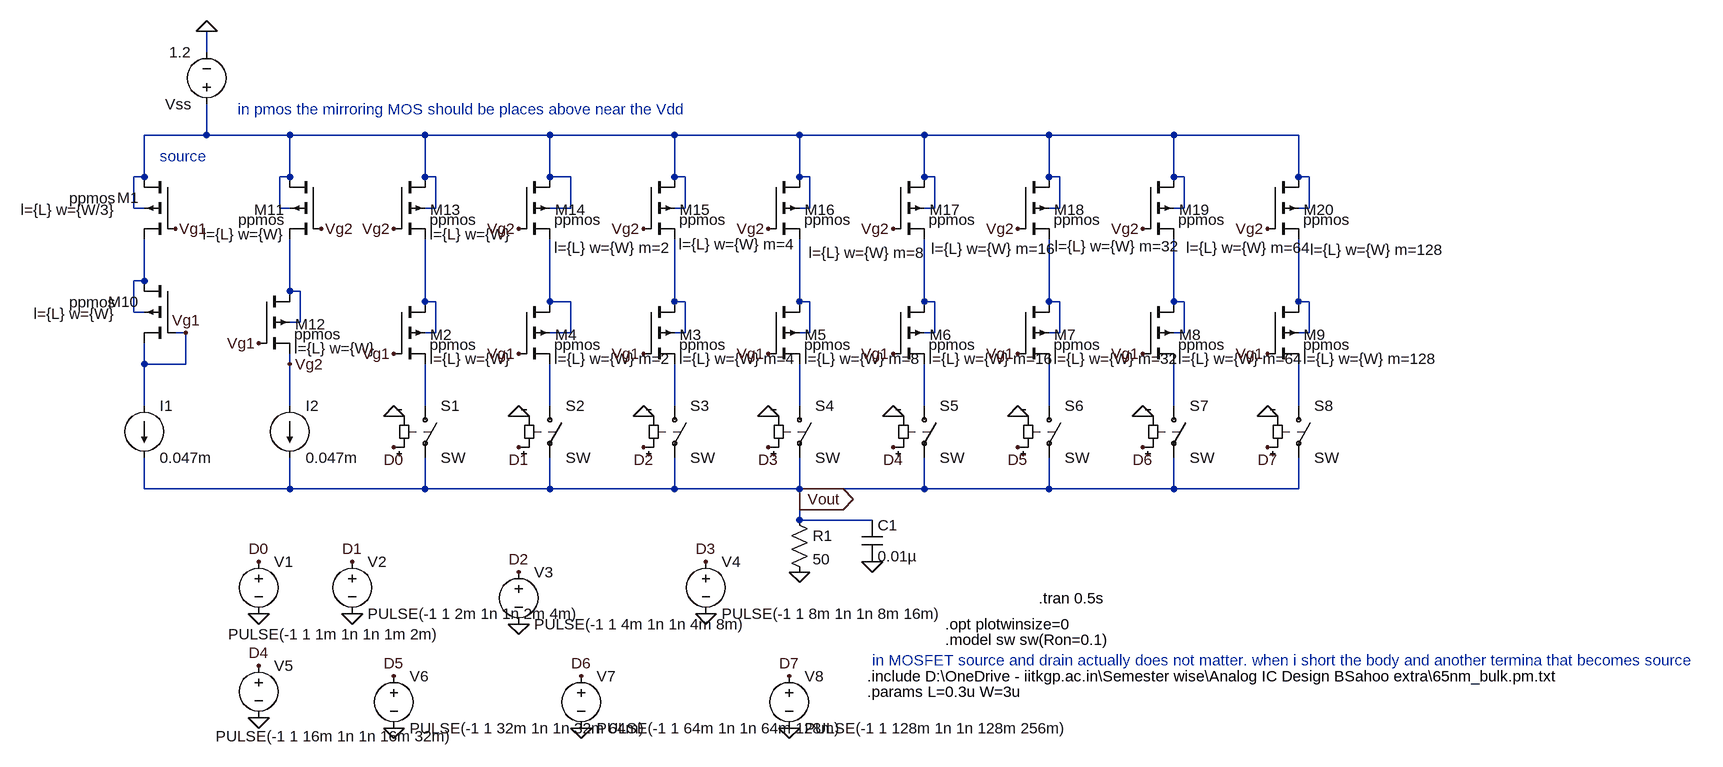
[diagram p0: schematic long_channel_pulse_generator.asc]
long_channel_pulse_generator.asc, the LTspice schematic file:
Version 4
SHEET 1 1092 1000
WIRE -816 -80 -816 -112
WIRE -816 48 -816 0
WIRE -816 48 -912 48
WIRE -688 48 -816 48
WIRE -480 48 -688 48
WIRE -288 48 -480 48
WIRE -96 48 -288 48
WIRE 96 48 -96 48
WIRE 288 48 96 48
WIRE 480 48 288 48
WIRE 672 48 480 48
WIRE 864 48 672 48
WIRE -912 112 -912 48
WIRE -912 112 -928 112
WIRE -688 112 -688 48
WIRE -688 112 -704 112
WIRE -480 112 -480 48
WIRE -464 112 -480 112
WIRE -288 112 -288 48
WIRE -256 112 -288 112
WIRE -96 112 -96 48
WIRE -80 112 -96 112
WIRE 96 112 96 48
WIRE 112 112 96 112
WIRE 288 112 288 48
WIRE 304 112 288 112
WIRE 480 112 480 48
WIRE 496 112 480 112
WIRE 672 112 672 48
WIRE 688 112 672 112
WIRE 864 112 864 48
WIRE 880 112 864 112
WIRE -928 160 -928 112
WIRE -912 160 -928 160
WIRE -704 160 -704 112
WIRE -688 160 -704 160
WIRE -464 160 -464 112
WIRE -464 160 -480 160
WIRE -256 160 -256 112
WIRE -256 160 -288 160
WIRE -80 160 -80 112
WIRE -80 160 -96 160
WIRE 112 160 112 112
WIRE 112 160 96 160
WIRE 304 160 304 112
WIRE 304 160 288 160
WIRE 496 160 496 112
WIRE 496 160 480 160
WIRE 688 160 688 112
WIRE 688 160 672 160
WIRE 880 160 880 112
WIRE 880 160 864 160
WIRE -912 272 -912 208
WIRE -912 272 -928 272
WIRE -688 288 -688 208
WIRE -672 288 -688 288
WIRE -480 304 -480 208
WIRE -464 304 -480 304
WIRE -288 304 -288 208
WIRE -256 304 -288 304
WIRE -96 304 -96 208
WIRE -80 304 -96 304
WIRE 96 304 96 208
WIRE 112 304 96 304
WIRE 288 304 288 208
WIRE 304 304 288 304
WIRE 480 304 480 208
WIRE 496 304 480 304
WIRE 672 304 672 208
WIRE 688 304 672 304
WIRE 864 304 864 208
WIRE 880 304 864 304
WIRE -928 320 -928 272
WIRE -912 320 -928 320
WIRE -672 336 -672 288
WIRE -672 336 -688 336
WIRE -848 352 -864 352
WIRE -464 352 -464 304
WIRE -464 352 -480 352
WIRE -256 352 -256 304
WIRE -256 352 -288 352
WIRE -80 352 -80 304
WIRE -80 352 -96 352
WIRE 112 352 112 304
WIRE 112 352 96 352
WIRE 304 352 304 304
WIRE 304 352 288 352
WIRE 496 352 496 304
WIRE 496 352 480 352
WIRE 688 352 688 304
WIRE 688 352 672 352
WIRE 880 352 880 304
WIRE 880 352 864 352
WIRE -912 400 -912 368
WIRE -848 400 -848 352
WIRE -848 400 -912 400
WIRE -688 400 -688 384
WIRE -912 464 -912 400
WIRE -688 464 -688 400
WIRE -480 464 -480 400
WIRE -288 464 -288 400
WIRE -96 464 -96 400
WIRE 96 464 96 400
WIRE 288 464 288 400
WIRE 480 464 480 400
WIRE 672 464 672 400
WIRE 864 464 864 400
WIRE -912 592 -912 544
WIRE -688 592 -688 544
WIRE -688 592 -912 592
WIRE -480 592 -480 544
WIRE -480 592 -688 592
WIRE -288 592 -288 544
WIRE -288 592 -480 592
WIRE -96 592 -96 544
WIRE -96 592 -288 592
WIRE 96 592 96 544
WIRE 96 592 -96 592
WIRE 288 592 288 544
WIRE 288 592 96 592
WIRE 480 592 480 544
WIRE 480 592 288 592
WIRE 672 592 672 544
WIRE 672 592 480 592
WIRE 864 592 864 544
WIRE 864 592 672 592
WIRE 96 608 96 592
WIRE 96 640 96 608
WIRE 208 640 96 640
FLAG -816 -112 0
FLAG -528 384 Vg1
FLAG 96 720 0
FLAG 96 608 Vout
IOPIN 96 608 Out
FLAG -336 384 Vg1
FLAG -144 384 Vg1
FLAG 48 384 Vg1
FLAG 240 384 Vg1
FLAG 432 384 Vg1
FLAG 624 384 Vg1
FLAG 816 384 Vg1
FLAG -528 528 D0
FLAG -336 528 D1
FLAG -144 528 D2
FLAG 48 528 D3
FLAG 240 528 D4
FLAG 432 528 D5
FLAG 624 528 D6
FLAG 816 528 D7
FLAG -528 480 0
FLAG -336 480 0
FLAG -144 480 0
FLAG 48 480 0
FLAG 240 480 0
FLAG 432 480 0
FLAG 624 480 0
FLAG 816 480 0
FLAG -736 784 0
FLAG -592 784 0
FLAG -336 800 0
FLAG -48 784 0
FLAG -240 960 0
FLAG -528 960 0
FLAG -736 944 0
FLAG -736 704 D0
FLAG -592 704 D1
FLAG -336 720 D2
FLAG -48 704 D3
FLAG -736 864 D4
FLAG -528 880 D5
FLAG -240 880 D6
FLAG 80 880 D7
FLAG 80 960 0
FLAG 208 704 0
FLAG -528 192 Vg2
FLAG -336 192 Vg2
FLAG -144 192 Vg2
FLAG 48 192 Vg2
FLAG 240 192 Vg2
FLAG 432 192 Vg2
FLAG 624 192 Vg2
FLAG 816 192 Vg2
FLAG -688 400 Vg2
FLAG -640 192 Vg2
FLAG -736 368 Vg1
FLAG -848 352 Vg1
FLAG -864 192 Vg1
SYMBOL voltage -816 16 R180
WINDOW 123 0 0 Left 0
WINDOW 39 0 0 Left 0
SYMATTR InstName Vss
SYMATTR Value 1.2
SYMBOL pmos4 -528 304 R0
WINDOW 3 55 66 Left 2
WINDOW 123 55 88 Left 2
WINDOW 0 56 51 Left 2
SYMATTR Value ppmos
SYMATTR Value2 l={L} w={W}
SYMATTR InstName M2
SYMBOL pmos4 -864 112 M0
WINDOW 3 91 33 Left 2
WINDOW 123 91 51 Left 2
SYMATTR Value ppmos
SYMATTR Value2 l={L} w={W/3}
SYMATTR InstName M1
SYMBOL current -912 464 R0
WINDOW 123 0 0 Left 0
WINDOW 39 0 0 Left 0
SYMATTR InstName I1
SYMATTR Value 0.047m
SYMBOL res 80 624 R0
SYMATTR InstName R1
SYMATTR Value 50
SYMBOL sw -480 448 R0
SYMATTR InstName S1
SYMBOL sw -288 448 R0
SYMATTR InstName S2
SYMBOL pmos4 -336 304 R0
WINDOW 3 55 66 Left 2
WINDOW 123 55 88 Left 2
WINDOW 0 56 51 Left 2
SYMATTR Value ppmos
SYMATTR Value2 l={L} w={W} m=2
SYMATTR InstName M4
SYMBOL pmos4 -144 304 R0
WINDOW 3 55 66 Left 2
WINDOW 123 55 88 Left 2
WINDOW 0 56 51 Left 2
SYMATTR Value ppmos
SYMATTR Value2 l={L} w={W} m=4
SYMATTR InstName M3
SYMBOL pmos4 48 304 R0
WINDOW 3 55 66 Left 2
WINDOW 123 55 88 Left 2
WINDOW 0 56 51 Left 2
SYMATTR Value ppmos
SYMATTR Value2 l={L} w={W} m=8
SYMATTR InstName M5
SYMBOL pmos4 240 304 R0
WINDOW 3 55 66 Left 2
WINDOW 123 55 88 Left 2
WINDOW 0 56 51 Left 2
SYMATTR Value ppmos
SYMATTR Value2 l={L} w={W} m=16
SYMATTR InstName M6
SYMBOL pmos4 432 304 R0
WINDOW 3 55 66 Left 2
WINDOW 123 55 88 Left 2
WINDOW 0 56 51 Left 2
SYMATTR Value ppmos
SYMATTR Value2 l={L} w={W} m=32
SYMATTR InstName M7
SYMBOL pmos4 624 304 R0
WINDOW 3 55 66 Left 2
WINDOW 123 55 88 Left 2
WINDOW 0 56 51 Left 2
SYMATTR Value ppmos
SYMATTR Value2 l={L} w={W} m=64
SYMATTR InstName M8
SYMBOL pmos4 816 304 R0
WINDOW 3 55 66 Left 2
WINDOW 123 55 88 Left 2
WINDOW 0 56 51 Left 2
SYMATTR Value ppmos
SYMATTR Value2 l={L} w={W} m=128
SYMATTR InstName M9
SYMBOL sw -96 448 R0
SYMATTR InstName S3
SYMBOL sw 96 448 R0
SYMATTR InstName S4
SYMBOL sw 288 448 R0
SYMATTR InstName S5
SYMBOL sw 480 448 R0
SYMATTR InstName S6
SYMBOL sw 672 448 R0
SYMATTR InstName S7
SYMBOL sw 864 448 R0
SYMATTR InstName S8
SYMBOL voltage -736 688 R0
WINDOW 3 -47 128 Left 2
WINDOW 123 0 0 Left 0
WINDOW 39 0 0 Left 0
SYMATTR Value PULSE(-1 1 1m 1n 1n 1m 2m)
SYMATTR InstName V1
SYMBOL voltage -592 688 R0
SYMATTR InstName V2
SYMATTR Value PULSE(-1 1 2m 1n 1n 2m 4m)
SYMBOL voltage -336 704 R0
SYMATTR InstName V3
SYMATTR Value PULSE(-1 1 4m 1n 1n 4m 8m)
SYMBOL voltage -48 688 R0
SYMATTR InstName V4
SYMATTR Value PULSE(-1 1 8m 1n 1n 8m 16m)
SYMBOL voltage -736 848 R0
WINDOW 3 -66 125 Left 2
SYMATTR Value PULSE(-1 1 16m 1n 1n 16m 32m)
SYMATTR InstName V5
SYMBOL voltage -528 864 R0
SYMATTR InstName V6
SYMATTR Value PULSE(-1 1 32m 1n 1n 32m 64m)
SYMBOL voltage -240 864 R0
SYMATTR InstName V7
SYMATTR Value PULSE(-1 1 64m 1n 1n 64m 128m)
SYMBOL voltage 80 864 R0
SYMATTR InstName V8
SYMATTR Value PULSE(-1 1 128m 1n 1n 128m 256m)
SYMBOL cap 192 640 R0
SYMATTR InstName C1
SYMATTR Value 0.01µ
SYMBOL pmos4 -864 272 M0
WINDOW 3 91 33 Left 2
WINDOW 123 91 51 Left 2
SYMATTR Value ppmos
SYMATTR Value2 l={L} w={W}
SYMATTR InstName M10
SYMBOL pmos4 -640 112 M0
WINDOW 3 55 66 Left 2
WINDOW 123 55 88 Left 2
WINDOW 0 56 51 Left 2
SYMATTR Value ppmos
SYMATTR Value2 l={L} w={W}
SYMATTR InstName M11
SYMBOL pmos4 -736 288 R0
WINDOW 3 55 66 Left 2
WINDOW 123 55 88 Left 2
WINDOW 0 56 51 Left 2
SYMATTR Value ppmos
SYMATTR Value2 l={L} w={W}
SYMATTR InstName M12
SYMBOL current -688 464 R0
WINDOW 123 0 0 Left 0
WINDOW 39 0 0 Left 0
SYMATTR InstName I2
SYMATTR Value 0.047m
SYMBOL pmos4 -528 112 R0
WINDOW 3 55 66 Left 2
WINDOW 123 55 88 Left 2
WINDOW 0 56 51 Left 2
SYMATTR Value ppmos
SYMATTR Value2 l={L} w={W}
SYMATTR InstName M13
SYMBOL pmos4 -336 112 R0
WINDOW 3 55 66 Left 2
WINDOW 123 55 109 Left 2
WINDOW 0 56 51 Left 2
SYMATTR Value ppmos
SYMATTR Value2 l={L} w={W} m=2
SYMATTR InstName M14
SYMBOL pmos4 -144 112 R0
WINDOW 3 55 66 Left 2
WINDOW 123 54 104 Left 2
WINDOW 0 56 51 Left 2
SYMATTR Value ppmos
SYMATTR Value2 l={L} w={W} m=4
SYMATTR InstName M15
SYMBOL pmos4 48 112 R0
WINDOW 3 55 66 Left 2
WINDOW 123 62 117 Left 2
WINDOW 0 56 51 Left 2
SYMATTR Value ppmos
SYMATTR Value2 l={L} w={W} m=8
SYMATTR InstName M16
SYMBOL pmos4 240 112 R0
WINDOW 3 55 66 Left 2
WINDOW 123 59 111 Left 2
WINDOW 0 56 51 Left 2
SYMATTR Value ppmos
SYMATTR Value2 l={L} w={W} m=16
SYMATTR InstName M17
SYMBOL pmos4 432 112 R0
WINDOW 3 55 66 Left 2
WINDOW 123 57 107 Left 2
WINDOW 0 56 51 Left 2
SYMATTR Value ppmos
SYMATTR Value2 l={L} w={W} m=32
SYMATTR InstName M18
SYMBOL pmos4 624 112 R0
WINDOW 3 55 66 Left 2
WINDOW 123 67 109 Left 2
WINDOW 0 56 51 Left 2
SYMATTR Value ppmos
SYMATTR Value2 l={L} w={W} m=64
SYMATTR InstName M19
SYMBOL pmos4 816 112 R0
WINDOW 3 55 66 Left 2
WINDOW 123 66 112 Left 2
WINDOW 0 56 51 Left 2
SYMATTR Value ppmos
SYMATTR Value2 l={L} w={W} m=128
SYMATTR InstName M20
TEXT 200 880 Left 2 !.include D:\\OneDrive - iitkgp.ac.in\\Semester wise\\Analog IC Design BSahoo extra\\65nm_bulk.pm.txt
TEXT 208 856 Left 2 ;in MOSFET source and drain actually does not matter. when i short the body and another termina that becomes source
TEXT 320 824 Left 2 !.model sw sw(Ron=0.1)
TEXT 464 760 Left 2 !.tran 0.5s
TEXT 320 800 Left 2 !.opt plotwinsize=0
TEXT 200 904 Left 2 !.params L=0.3u W=3u
TEXT -888 80 Left 2 ;source
TEXT -768 8 Left 2 ;in pmos the mirroring MOS should be places above near the Vdd

The netlist it stands for:
* long_channel_pulse_generator.asc
Vss N001 0 1.2
M2 N004 Vg1 N012 N004 ppmos l={L} w={W}
M1 N001 Vg1 N002 N001 ppmos l={L} w={W/3}
I1 Vg1 Vout 0.047m
R1 Vout 0 50
S1 N012 Vout D0 0 SW
S2 N013 Vout D1 0 SW
M4 N005 Vg1 N013 N005 ppmos l={L} w={W} m=2
M3 N006 Vg1 N014 N006 ppmos l={L} w={W} m=4
M5 N007 Vg1 N015 N007 ppmos l={L} w={W} m=8
M6 N008 Vg1 N016 N008 ppmos l={L} w={W} m=16
M7 N009 Vg1 N017 N009 ppmos l={L} w={W} m=32
M8 N010 Vg1 N018 N010 ppmos l={L} w={W} m=64
M9 N011 Vg1 N019 N011 ppmos l={L} w={W} m=128
S3 N014 Vout D2 0 SW
S4 N015 Vout D3 0 SW
S5 N016 Vout D4 0 SW
S6 N017 Vout D5 0 SW
S7 N018 Vout D6 0 SW
S8 N019 Vout D7 0 SW
V1 D0 0 PULSE(-1 1 1m 1n 1n 1m 2m)
V2 D1 0 PULSE(-1 1 2m 1n 1n 2m 4m)
V3 D2 0 PULSE(-1 1 4m 1n 1n 4m 8m)
V4 D3 0 PULSE(-1 1 8m 1n 1n 8m 16m)
V5 D4 0 PULSE(-1 1 16m 1n 1n 16m 32m)
V6 D5 0 PULSE(-1 1 32m 1n 1n 32m 64m)
V7 D6 0 PULSE(-1 1 64m 1n 1n 64m 128m)
V8 D7 0 PULSE(-1 1 128m 1n 1n 128m 256m)
C1 Vout 0 0.01µ
M10 N002 Vg1 Vg1 N002 ppmos l={L} w={W}
M11 N001 Vg2 N003 N001 ppmos l={L} w={W}
M12 N003 Vg1 Vg2 N003 ppmos l={L} w={W}
I2 Vg2 Vout 0.047m
M13 N001 Vg2 N004 N001 ppmos l={L} w={W}
M14 N001 Vg2 N005 N001 ppmos l={L} w={W} m=2
M15 N001 Vg2 N006 N001 ppmos l={L} w={W} m=4
M16 N001 Vg2 N007 N001 ppmos l={L} w={W} m=8
M17 N001 Vg2 N008 N001 ppmos l={L} w={W} m=16
M18 N001 Vg2 N009 N001 ppmos l={L} w={W} m=32
M19 N001 Vg2 N010 N001 ppmos l={L} w={W} m=64
M20 N001 Vg2 N011 N001 ppmos l={L} w={W} m=128
.model NMOS NMOS
.model PMOS PMOS
.lib standard.mos
.include D:\OneDrive - iitkgp.ac.in\Semester wise\Analog IC Design BSahoo extra\65nm_bulk.pm.txt
* in MOSFET source and drain actually does not matter. when i short the body and another termina that becomes source
.model sw sw(Ron=0.1)
.tran 0.5s
.opt plotwinsize=0
.params L=0.3u W=3u
* source
* in pmos the mirroring MOS should be places above near the Vdd
.backanno
.end